# Altium schematic sheet yard-ice-fpga.SchDoc: Yard-Ice-FPGA
size 365 x 274 mm; Revision: 0.2; SheetNumber: 4; SheetTotal: 5
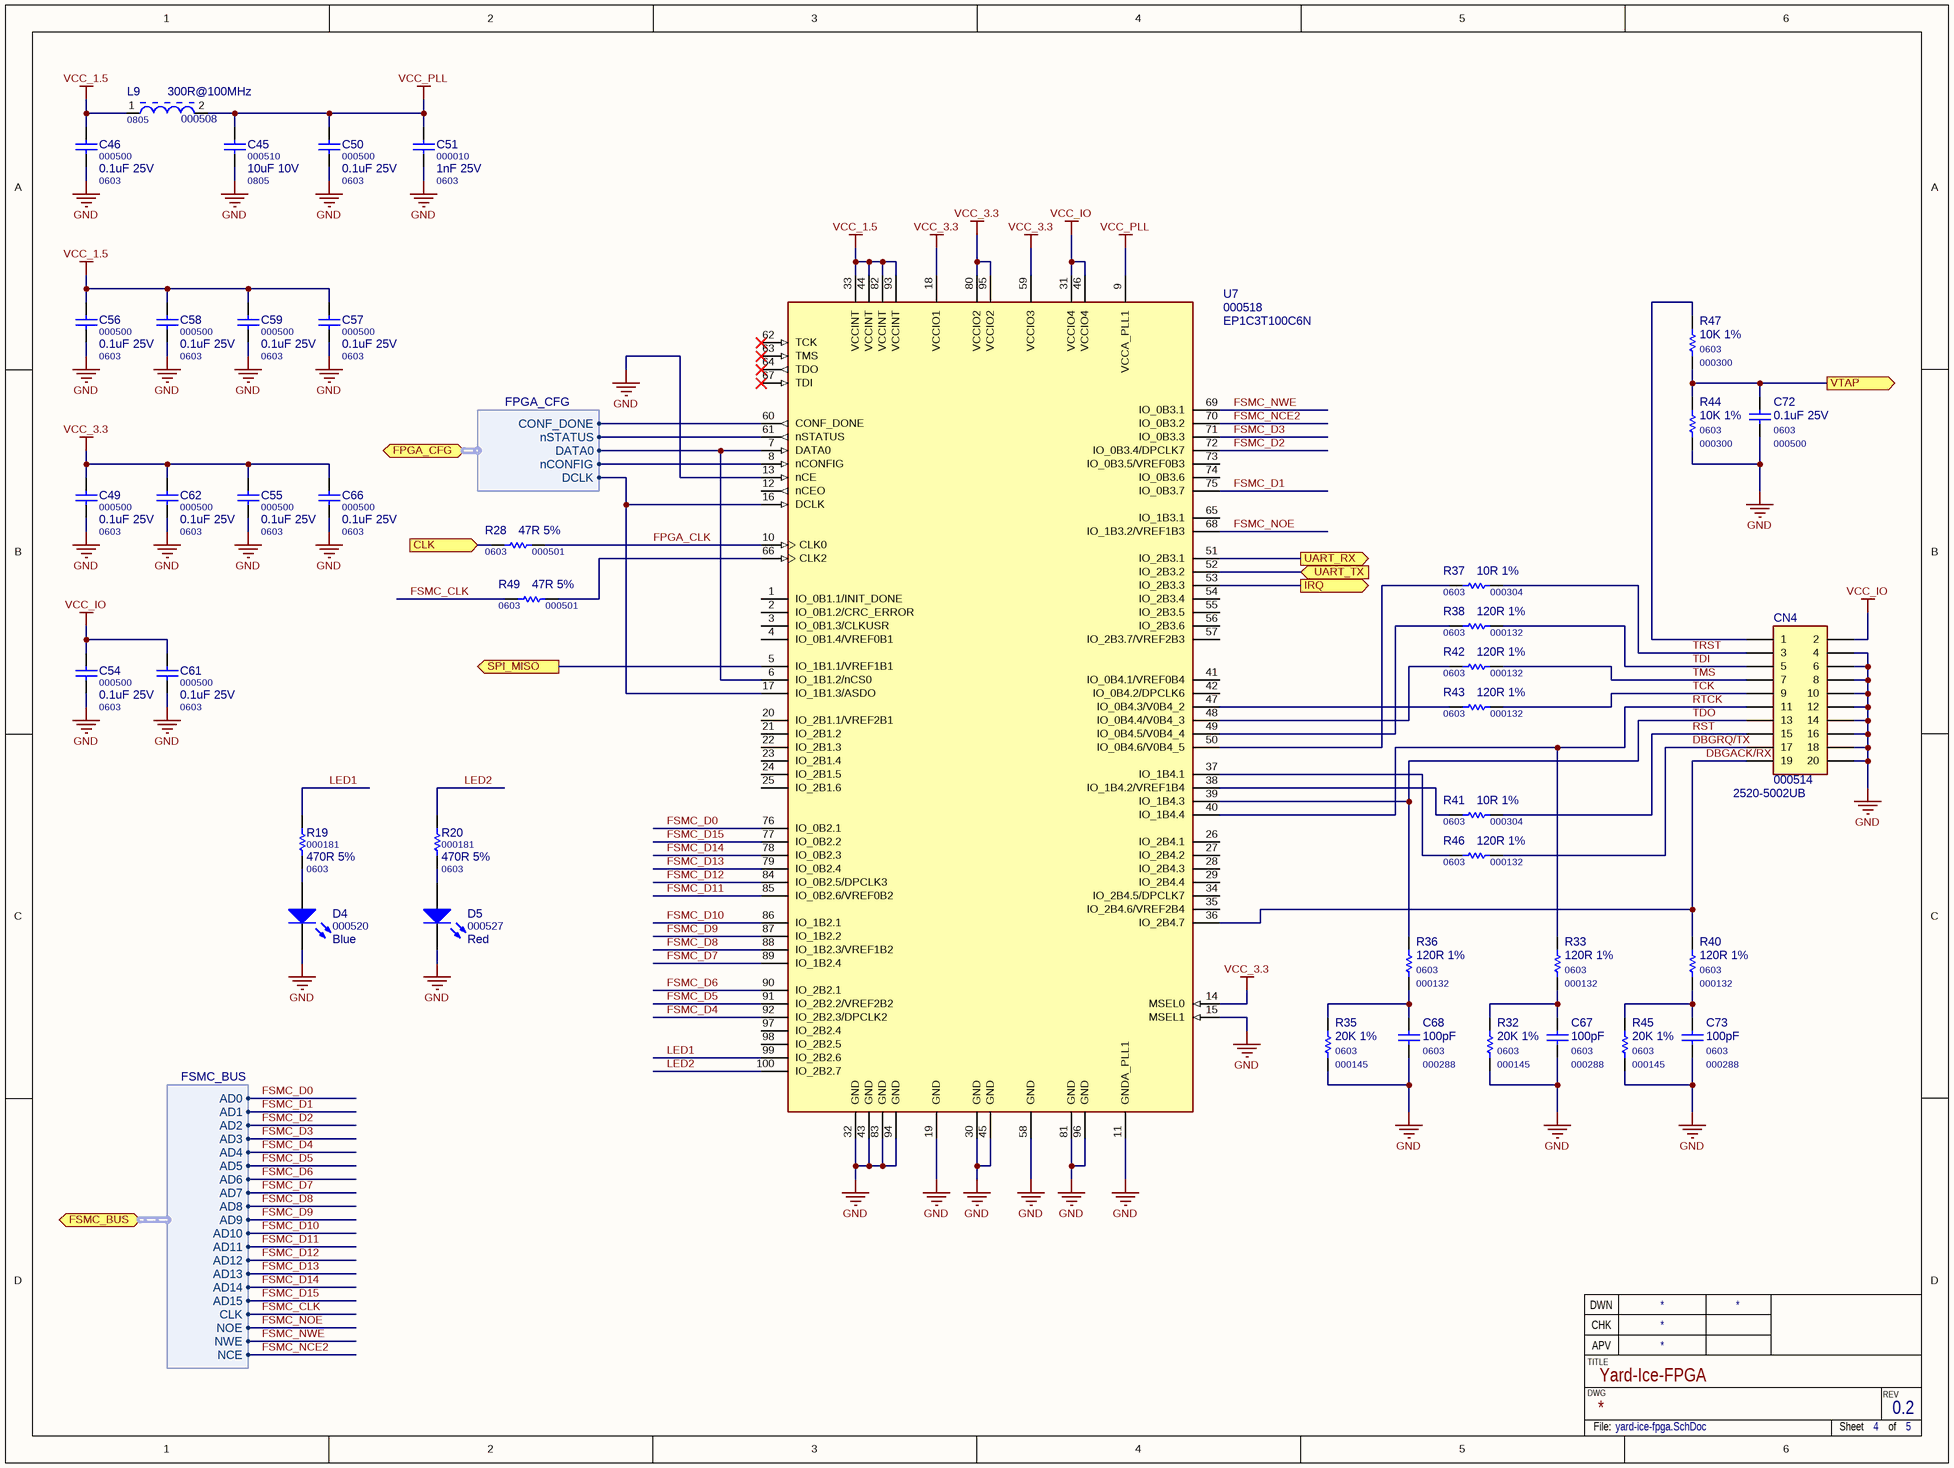
[diagram p0: yard-ice-fpga.SchDoc]

## Parts
C45  000510  value 10uF 10V  Package: 0805  [C0805M]
C46  000500  value 0.1uF 25V  Package: 0603  [C0603M]
C49  000500  value 0.1uF 25V  Package: 0603  [C0603M]
C50  000500  value 0.1uF 25V  Package: 0603  [C0603M]
C51  000010  value 1nF 25V  Package: 0603  [C0603M]
C54  000500  value 0.1uF 25V  Package: 0603  [C0603M]
C55  000500  value 0.1uF 25V  Package: 0603  [C0603M]
C56  000500  value 0.1uF 25V  Package: 0603  [C0603M]
C57  000500  value 0.1uF 25V  Package: 0603  [C0603M]
C58  000500  value 0.1uF 25V  Package: 0603  [C0603M]
C59  000500  value 0.1uF 25V  Package: 0603  [C0603M]
C61  000500  value 0.1uF 25V  Package: 0603  [C0603M]
C62  000500  value 0.1uF 25V  Package: 0603  [C0603M]
C66  000500  value 0.1uF 25V  Package: 0603  [C0603M]
C67  000288  value 100pF  Package: 0603  [C0603M]
C68  000288  value 100pF  Package: 0603  [C0603M]
C72  000500  value 0.1uF 25V  Package: 0603  [C0603M]
C73  000288  value 100pF  Package: 0603  [C0603M]
CN4  000514  value 2520-5002UB  [TST-110-04-G-D-RA]
D4  000520  value Blue  [LED0805L LP]
D5  000527  value Red  [LED0805L LP]
L9  000508  value 300R@100MHz  Package: 0805  [L0805M]
R19  000181  value 470R 5%  Package: 0603  [R0603M]
R20  000181  value 470R 5%  Package: 0603  [R0603M]
R28  000501  value 47R 5%  Package: 0603  [R0603M]
R32  000145  value 20K 1%  Package: 0603  [R0603M]
R33  000132  value 120R 1%  Package: 0603  [R0603M]
R35  000145  value 20K 1%  Package: 0603  [R0603M]
R36  000132  value 120R 1%  Package: 0603  [R0603M]
R37  000304  value 10R 1%  Package: 0603  [R0603M]
R38  000132  value 120R 1%  Package: 0603  [R0603M]
R40  000132  value 120R 1%  Package: 0603  [R0603M]
R41  000304  value 10R 1%  Package: 0603  [R0603M]
R42  000132  value 120R 1%  Package: 0603  [R0603M]
R43  000132  value 120R 1%  Package: 0603  [R0603M]
R44  000300  value 10K 1%  Package: 0603  [R0603M]
R45  000145  value 20K 1%  Package: 0603  [R0603M]
R46  000132  value 120R 1%  Package: 0603  [R0603M]
R47  000300  value 10K 1%  Package: 0603  [R0603M]
R49  000501  value 47R 5%  Package: 0603  [R0603M]
U7  000518  value EP1C3T100C6N  [TQFP-100]

## Ports
CLK (in), FPGA_CFG (harness FPGA_CFG), FSMC_BUS (harness FSMC_BUS), IRQ (out), SPI_MISO (out), UART_RX (out), UART_TX (in), VTAP (out)

## Harnesses
FSMC_BUS: AD0, AD1, AD2, AD3, AD4, AD5, AD6, AD7, AD8, AD9, AD10, AD11, AD12, AD13, AD14, AD15, CLK, NOE, NWE, NCE
FPGA_CFG: CONF_DONE, nSTATUS, DATA0, nCONFIG, DCLK

## Nets
GND: C45.2 C46.2 C49.2 C50.2 C51.2 C54.2 C55.2 C56.2 C57.2 C58.2 C59.2 C61.2 C62.2 C66.2 C67.2 C68.2 C72.2 C73.2 CN4.4 CN4.6 CN4.8 CN4.10 CN4.12 CN4.14 CN4.16 CN4.18 CN4.20 D4.2(K) D5.2(K) R32.2 R35.2 R44.2 R45.2 U7.11(GNDA_PLL1) U7.13(nCE) U7.15(MSEL1) U7.19(GND) U7.30(GND) U7.32(GND) U7.43(GND) U7.45(GND) U7.58(GND) U7.81(GND) U7.83(GND) U7.94(GND) U7.96(GND)
VCC_1.5: C46.1 C56.1 C57.1 C58.1 C59.1 L9.1 U7.33(VCCINT) U7.44(VCCINT) U7.82(VCCINT) U7.93(VCCINT)
VCC_3.3: C49.1 C55.1 C62.1 C66.1 U7.14(MSEL0) U7.18(VCCIO1) U7.59(VCCIO3) U7.80(VCCIO2) U7.95(VCCIO2)
VCC_IO: C54.1 C61.1 CN4.2 U7.31(VCCIO4) U7.46(VCCIO4)
VCC_PLL: C45.1 C50.1 C51.1 L9.2 U7.9(VCCA_PLL1)
CLK: R28.2 ; port CLK
DBGACK/RX: CN4.19 R40.1 U7.36(IO_2B4.7)
DBGRQ/TX: CN4.17 R46.1
FPGA_CLK: R28.1 U7.10(CLK0)
FSMC_CLK: R49.2 ; port FSMC_BUS.CLK
FSMC_D0: U7.76(IO_0B2.1) ; port FSMC_BUS.AD0
FSMC_D1: U7.75(IO_0B3.7) ; port FSMC_BUS.AD1
FSMC_D2: U7.72(IO_0B3.4/DPCLK7) ; port FSMC_BUS.AD2
FSMC_D3: U7.71(IO_0B3.3) ; port FSMC_BUS.AD3
FSMC_D4: U7.92(IO_2B2.3/DPCLK2) ; port FSMC_BUS.AD4
FSMC_D5: U7.91(IO_2B2.2/VREF2B2) ; port FSMC_BUS.AD5
FSMC_D6: U7.90(IO_2B2.1) ; port FSMC_BUS.AD6
FSMC_D7: U7.89(IO_1B2.4) ; port FSMC_BUS.AD7
FSMC_D8: U7.88(IO_1B2.3/VREF1B2) ; port FSMC_BUS.AD8
FSMC_D9: U7.87(IO_1B2.2) ; port FSMC_BUS.AD9
FSMC_D10: U7.86(IO_1B2.1) ; port FSMC_BUS.AD10
FSMC_D11: U7.85(IO_0B2.6/VREF0B2) ; port FSMC_BUS.AD11
FSMC_D12: U7.84(IO_0B2.5/DPCLK3) ; port FSMC_BUS.AD12
FSMC_D13: U7.79(IO_0B2.4) ; port FSMC_BUS.AD13
FSMC_D14: U7.78(IO_0B2.3) ; port FSMC_BUS.AD14
FSMC_D15: U7.77(IO_0B2.2) ; port FSMC_BUS.AD15
FSMC_NCE2: U7.70(IO_0B3.2) ; port FSMC_BUS.NCE
FSMC_NOE: U7.68(IO_1B3.2/VREF1B3) ; port FSMC_BUS.NOE
FSMC_NWE: U7.69(IO_0B3.1) ; port FSMC_BUS.NWE
IRQ: U7.53(IO_2B3.3) ; port IRQ
LED1: R19.1 U7.99(IO_2B2.6)
LED2: R20.1 U7.100(IO_2B2.7)
RST: CN4.15 R41.1
RTCK: CN4.11 R33.1 U7.40(IO_1B4.4)
SPI_MISO: U7.5(IO_1B1.1/VREF1B1) ; port SPI_MISO
TCK: CN4.9 R43.1
TDI: CN4.5 R38.1
TDO: CN4.13 R36.1 U7.39(IO_1B4.3)
TMS: CN4.7 R42.1
TRST: CN4.3 R37.1
UART_RX: U7.51(IO_2B3.1) ; port UART_RX
UART_TX: U7.52(IO_2B3.2) ; port UART_TX
VTAP: C72.1 R44.1 R47.2 ; port VTAP
NetC67_1: C67.1 R32.1 R33.2
NetC68_1: C68.1 R35.1 R36.2
NetC73_1: C73.1 R40.2 R45.1
NetCN4_1: CN4.1 R47.1
NetD4_1: D4.1(A) R19.2
NetD5_1: D5.1(A) R20.2
NetR37_2: R37.2 U7.50(IO_0B4.6/V0B4_5)
NetR38_2: R38.2 U7.49(IO_0B4.5/V0B4_4)
NetR41_2: R41.2 U7.38(IO_1B4.2/VREF1B4)
NetR42_2: R42.2 U7.48(IO_0B4.4/V0B4_3)
NetR43_2: R43.2 U7.47(IO_0B4.3/V0B4_2)
NetR46_2: R46.2 U7.37(IO_1B4.1)
NetR49_1: R49.1 U7.66(CLK2)
NetU7_6: U7.6(IO_1B1.2/nCS0) U7.7(DATA0) ; port FPGA_CFG.DATA0
NetU7_8: U7.8(nCONFIG) ; port FPGA_CFG.nCONFIG
NetU7_16: U7.16(DCLK) U7.17(IO_1B1.3/ASDO) ; port FPGA_CFG.DCLK
NetU7_60: U7.60(CONF_DONE) ; port FPGA_CFG.CONF_DONE
NetU7_61: U7.61(nSTATUS) ; port FPGA_CFG.nSTATUS

Not connected (* = marked no-connect by the designer): U7 1(IO_0B1.1/INIT_DONE) 2(IO_0B1.2/CRC_ERROR) 3(IO_0B1.3/CLKUSR) 4(IO_0B1.4/VREF0B1) 12(nCEO) 20(IO_2B1.1/VREF2B1) 21(IO_2B1.2) 22(IO_2B1.3) 23(IO_2B1.4) 24(IO_2B1.5) 25(IO_2B1.6) 26(IO_2B4.1) 27(IO_2B4.2) 28(IO_2B4.3) 29(IO_2B4.4) 34(IO_2B4.5/DPCLK7) 35(IO_2B4.6/VREF2B4) 41(IO_0B4.1/VREF0B4) 42(IO_0B4.2/DPCLK6) 54(IO_2B3.4) 55(IO_2B3.5) 56(IO_2B3.6) 57(IO_2B3.7/VREF2B3) 62(TCK)* 63(TMS)* 64(TDO)* 65(IO_1B3.1) 67(TDI)* 73(IO_0B3.5/VREF0B3) 74(IO_0B3.6) 97(IO_2B2.4) 98(IO_2B2.5)

## Notes on the sheet
- TITLE
- CHK
- DWN
- APV
- DWG
- REV
- File:
- Sheet
- of

## Library data of the parts
C45 = C0805: SMD Ceramic Chip Capacitor - 0805 - X7R; MF PN: C2012X7R1A106K; MF: TDK; PN: 000510
C46 C49 C50 C54-C59 C61 C62 C66 C72 = C0603: SMD Ceramic Chip Capacitor - 0603 - X7R; MF PN: C1608X7R1E104K; MF: TDK; PN: 000500
C51 = C0603: SMD Ceramic Chip Capacitor - 0603 - X7R; PN: 000010
C67 C68 C73 = C0603: SMD Ceramic Chip Capacitor - 0603; PN: 000288
CN4 = Header 10X2: Shrouded Header, 20 Pos, Right Angle; MF: 3M; PN: 000514; Package: PTH; MF PN: 2520-5002UB
D4 D5 = LED0805LP: LED SMD 0805; Package: 0805
  D4: PN: 000520
  D5: PN: 000527
L9 = L0805: SMD Ferrite Bead 0805; MF PN: MMZ2012Y301B; MF: TDK; PN: 000508
R19 R20 R28 R32 R33 R35-R38 R40-R47 R49 = R0603: SMD Chip Resistor - 0603
  R19 R20: PN: 000181
  R28 R49: PN: 000501
  R32 R35 R45: PN: 000145
  R33 R36 R38 R40 R42 R43 R46: PN: 000132
  R37 R41: PN: 000304
  R44 R47: PN: 000300
U7 = EP1C3T100C8N: Cyclone FPGA; MF: Altera; Package: 100-TQFP; PN: 000518; MF PN: EP1C3T100C6N